# EAGLE schematic Neon_Fader_V2_v376 (EAGLE 9.7.0)
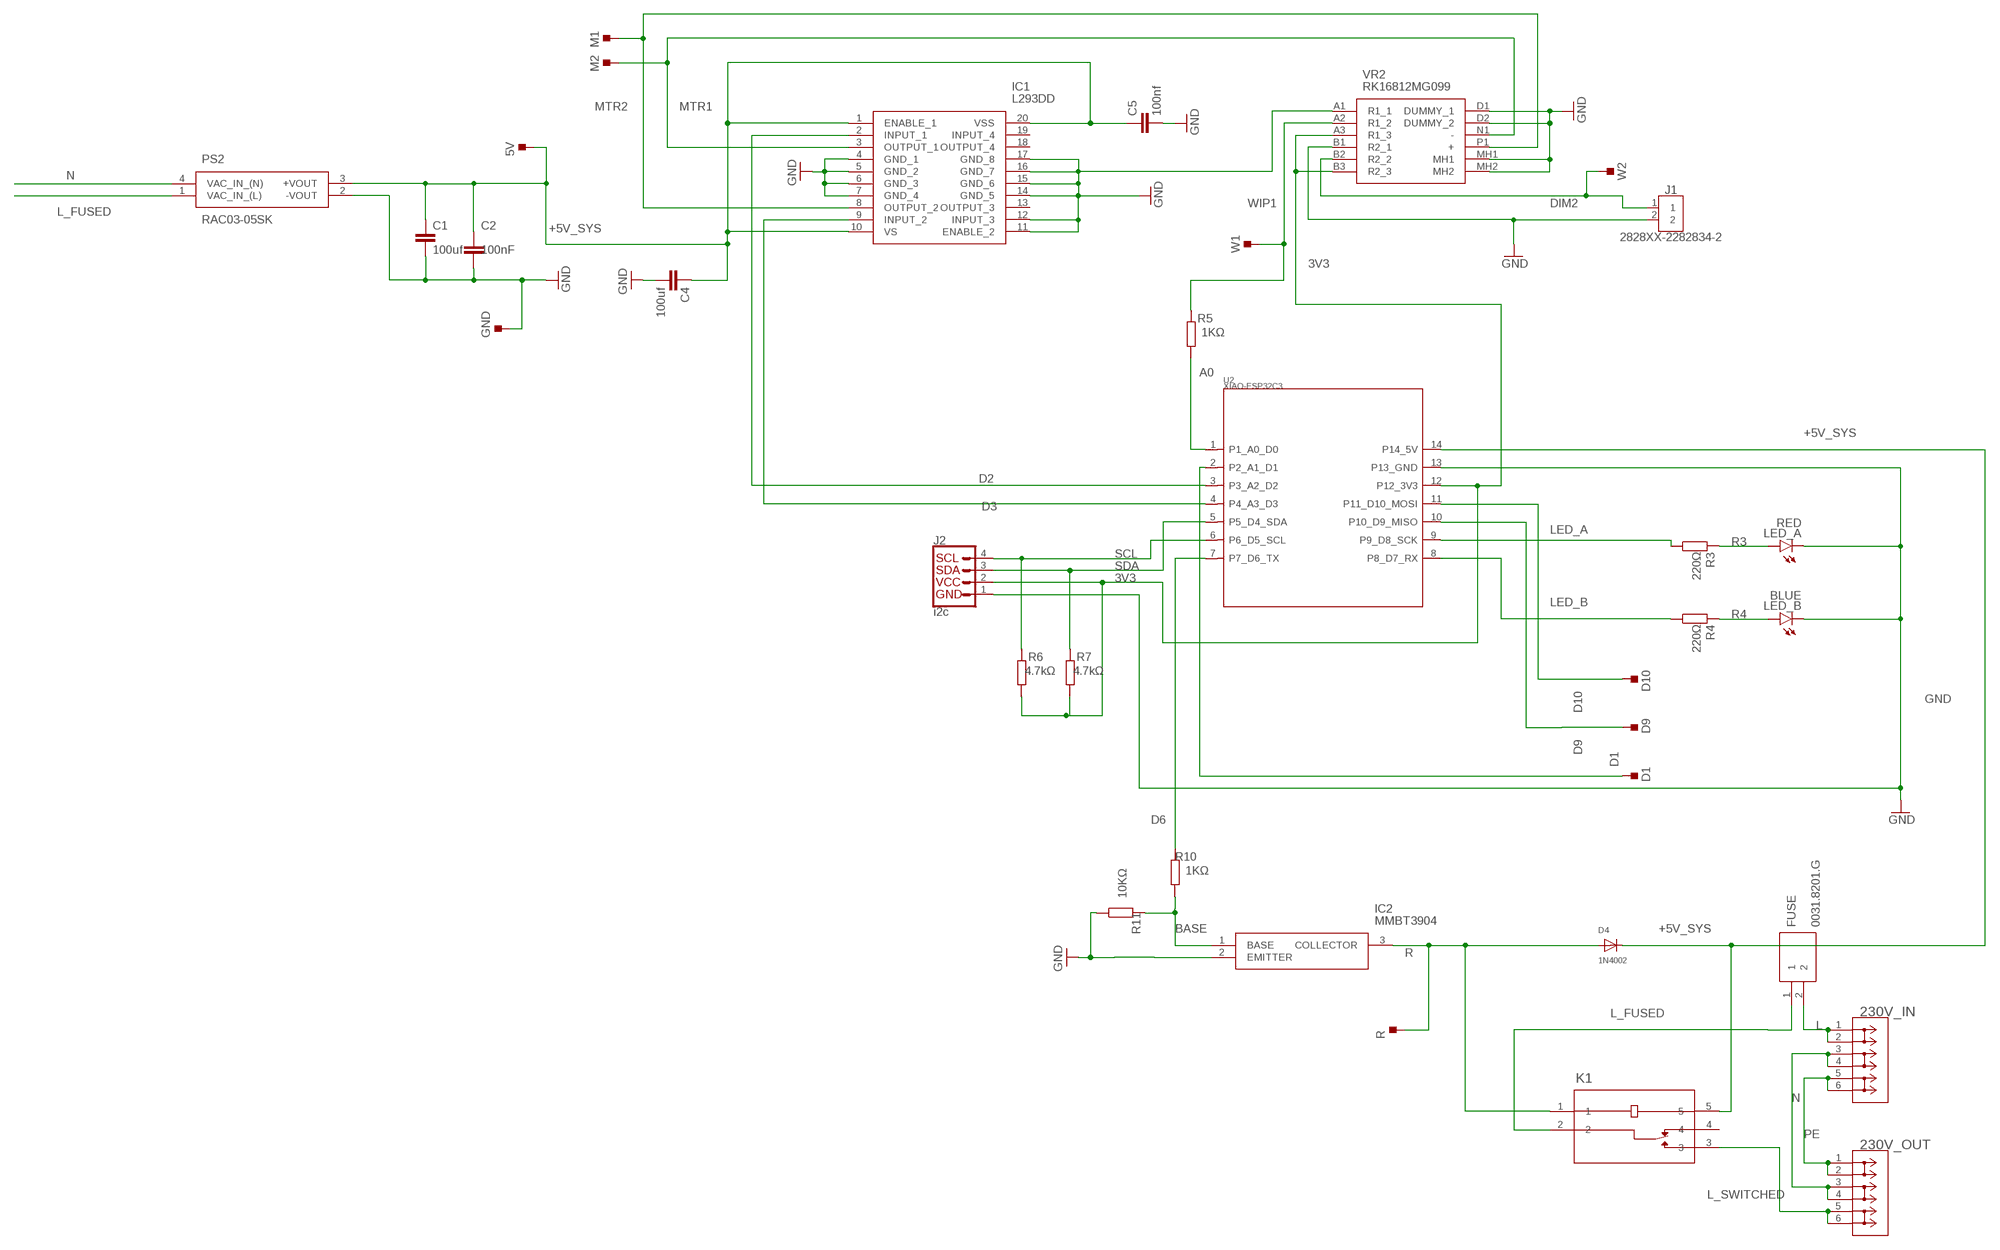
[diagram p0: schematic, sheet 1]

## Parts
5V  TESTPOINT_TPS-PAD-036  [TESTPOINT_PAD-036]
230V_IN  2604-1103CONN3_2604-1103_WAG  [CONN3_2604-1103_WAG]
230V_OUT  2604-1103CONN3_2604-1103_WAG  [CONN3_2604-1103_WAG]
C1  100uf  C-EUC1210  [C1210]
C2  100nF  C-EUC0402  [C0402]
C4  100uf  C-EUC1210  [C1210]
C5  100nf  C-EUC0402  [C0402]
D1  TESTPOINT_TPS-PAD-036  [TESTPOINT_PAD-036]
D4  1N4002  DIODESOD-123  [SOD-123]
D9  TESTPOINT_TPS-PAD-036  [TESTPOINT_PAD-036]
D10  TESTPOINT_TPS-PAD-036  [TESTPOINT_PAD-036]
FUSE  0031.8201.G  [00318201G]
GND  TESTPOINT_TPS-PAD-036  [TESTPOINT_PAD-036]
IC1  L293DD  [SOIC127P1032X265-20N]
IC2  MMBT3904  [SOT95P240X110-3N]
J1  2828XX-2282834-2  [TERMBLK_254-2N]
J2  i2c  QWIIC_CONNECTORJS-1MM  [1X04_1MM_RA]
K1  G6RN-1_DC5RELAY_G6RN-1_OMR  [RELAY_G6RN-1_OMR]
LED_A  RED  LEDCHIPLED_1206  [CHIPLED_1206]
LED_B  BLUE  LEDCHIPLED_1206  [CHIPLED_1206]
M1  TESTPOINT_TPS-PAD-036  [TESTPOINT_PAD-036]
M2  TESTPOINT_TPS-PAD-036  [TESTPOINT_PAD-036]
PS2  RAC03-05SK  [RAC0305SK]
R  TESTPOINT_TPS-PAD-036  [TESTPOINT_PAD-036]
R3  220Ω  R-EU_R0402  [R0402]
R4  220Ω  R-EU_R0402  [R0402]
R5  1KΩ  R-EU_R0402  [R0402]
R6  4.7kΩ  R-EU_R0402  [R0402]
R7  4.7kΩ  R-EU_R0402  [R0402]
R10  1KΩ  R-EU_R0402  [R0402]
R11  10KΩ  R-EU_R0402  [R0402]
U2  XIAO-ESP32C3  XIAO-THRUHOLEHYBRID-SMT-THT  [XIAO-GENERIC-HYBRID-MODULE14P-2.54-21X17.8MM]
VR2  RK16812MG099  [RK16812MG099]
W1  TESTPOINT_TPS-PAD-036  [TESTPOINT_PAD-036]
W2  TESTPOINT_TPS-PAD-036  [TESTPOINT_PAD-036]

## Nets
3V3 [DC]: J2.2(VCC) R6.1 R7.1 U2.12(P12_3V3) VR2.A3(R1_3) VR2.B3(R2_3)
+5V_SYS [DC]: 5V.1(TP) C1.1 C2.1 C4.1 C5.1 D4.C IC1.1(ENABLE_1) IC1.10(VS) IC1.20(VSS) K1.5 PS2.3(+VOUT) U2.14(P14_5V)
A0 [DATA]: R5.1 U2.1(P1_A0_D0)
BASE [DATA]: IC2.1(BASE) R10.1 R11.2
D1 [DATA]: D1.1(TP) U2.2(P2_A1_D1)
D2 [DATA]: IC1.2(INPUT_1) U2.3(P3_A2_D2)
D3 [DATA]: IC1.9(INPUT_2) U2.4(P4_A3_D3)
D6 [DATA]: R10.2 U2.7(P7_D6_TX)
D9 [DATA]: D9.1(TP) U2.10(P10_D9_MISO)
D10 [DATA]: D10.1(TP) U2.11(P11_D10_MOSI)
DIM2 [DATA]: J1.1 VR2.B2(R2_2) W2.1(TP)
GND [DC]: C1.2 C2.2 C4.2 C5.2 GND.1(TP) IC1.4(GND_1) IC1.5(GND_2) IC1.6(GND_3) IC1.7(GND_4) IC1.11(ENABLE_2) IC1.12(INPUT_3) IC1.14(GND_5) IC1.15(GND_6) IC1.16(GND_7) IC1.17(GND_8) IC2.2(EMITTER) J1.2 J2.1(GND) LED_A.C LED_B.C PS2.2(-VOUT) R11.1 U2.13(P13_GND) VR2.A1(R1_1) VR2.B1(R2_1) VR2.D1(DUMMY_1) VR2.D2(DUMMY_2) VR2.MH1 VR2.MH2
L [AC]: 230V_IN.1(1_1) 230V_IN.2(1_2) FUSE.2
L_FUSED [AC]: FUSE.1 K1.2 PS2.1(VAC_IN_(L))
L_SWITCHED [AC]: 230V_OUT.5(3_1) 230V_OUT.6(3_2) K1.3
LED_A [DATA]: R3.1 U2.9(P9_D8_SCK)
LED_B [DATA]: R4.1 U2.8(P8_D7_RX)
MTR1 [DC]: IC1.3(OUTPUT_1) M2.1(TP) VR2.N1(-)
MTR2 [DC]: IC1.8(OUTPUT_2) M1.1(TP) VR2.P1(+)
N [AC]: 230V_IN.3(2_1) 230V_IN.4(2_2) 230V_OUT.3(2_1) 230V_OUT.4(2_2) PS2.4(VAC_IN_(N))
PE [AC]: 230V_IN.5(3_1) 230V_IN.6(3_2) 230V_OUT.1(1_1) 230V_OUT.2(1_2)
R [DATA]: D4.A IC2.3(COLLECTOR) K1.1 R.1(TP)
R3 [DATA]: LED_A.A R3.2
R4 [DATA]: LED_B.A R4.2
SCL [DATA]: J2.4(SCL) R6.2 U2.6(P6_D5_SCL)
SDA [DATA]: J2.3(SDA) R7.2 U2.5(P5_D4_SDA)
WIP1 [DATA]: R5.2 VR2.A2(R1_2) W1.1(TP)
Unconnected: IC1.13(OUTPUT_3) IC1.18(OUTPUT_4) IC1.19(INPUT_4) K1.4

## Library data of the parts
5V D1 D9 D10 GND M1 M2 R W1 W2 = 52101-101-REV-A_v16:TESTPOINT_TPS: TEST POINT PAD; BOM: EXCLUDE
230V_IN 230V_OUT = Wago 2604-1103 Lib:2604-1103; COPYRIGHT: Copyright (C) 2026 Ultra Librarian. All rights reserved.; MANUFACTURER_NAME: Wago; MANUFACTURER_PART_NUMBER: 2604-1103
C1 C2 C4 C5 = rcl:C-EU: CAPACITOR, European symbol; SPICEPREFIX: C
D4 = adafruit:DIODE: Diode SMADIODE - SMA Surface Mount Package 20V 1A Schottky Diode Digikey: 641-1014-6-ND DO-1N4148 - Through Hole Small Current Diode SOD-123 20V 1 A (.5mV Vf) Schottky Diode - Digikey: MBRX120TPMSCT-ND SOD-323 10V 570mA (.38mV Vf, 3ns) Schottky Diode - Digikey: ZLLS410CT-ND SOD-523 30V 30mA Schottky Diode (RB751S-40TE61) - Digikey: RB751S-40TE61CT-ND SOT23-R/W - SOT23 Package (R = Solder Paste/Reflow Ovens, W = Hand-Soldering) BAT54Film 40V 300mA - Digikey: 497-7162-1-ND
FUSE = 0031.8201:0031.8201.G: OGN for THT 22.5mm Source: Datasheet <https://www.schurter.com/en/datasheet/ogn>; ARROW_PART_NUMBER: 0031.8201.G; ARROW_PRICE-STOCK: https://www.arrow.com/en/products/0031.8201.g/schurter?region=europe; DESCRIPTION: OGN for THT 22.5mm; HEIGHT: 12.7mm; MANUFACTURER_NAME: SCHURTER; MANUFACTURER_PART_NUMBER: 0031.8201.G; MOUSER_PART_NUMBER: 693-0031.8201.G; MOUSER_PRICE-STOCK: https://www.mouser.co.uk/ProductDetail/Schurter/0031.8201.G?qs=53fxdJjyGHQ26HnfkWkpvg%3D%3D
IC1 = L293DD:L293DD: L293DD, Motor Driver, 4.5 36 V, 20-Pin SOIC Source: Datasheet <https://www.st.com/resource/en/datasheet/l293d.pdf>; ARROW_PART_NUMBER: L293DD; ARROW_PRICE-STOCK: https://www.arrow.com/en/products/l293dd/stmicroelectronics.html?utm_currency=USD&region=europe; DESCRIPTION: L293DD, Motor Driver, 4.5 36 V, 20-Pin SOIC; HEIGHT: 2.65mm; MANUFACTURER_NAME: STMicroelectronics; MANUFACTURER_PART_NUMBER: L293DD; MOUSER_PART_NUMBER: 511-L293DD; MOUSER_PRICE-STOCK: https://www.mouser.co.uk/ProductDetail/STMicroelectronics/L293DD?qs=m4gxtLzGBzoksItTiSkcgg%3D%3D
IC2 = MMBT3904:MMBT3904: Bipolar Transistors - BJT SOT23 NPN 0.2A 40V G enPur Source: Datasheet <https://www.arrow.com/en/products/mmbt3904/rectron>; ARROW_PART_NUMBER: MMBT3904; ARROW_PRICE-STOCK: https://www.arrow.com/en/products/mmbt3904/rectron?utm_currency=USD&region=nac; DESCRIPTION: Bipolar Transistors - BJT SOT23 NPN 0.2A 40V G enPur; HEIGHT: 1.1mm; MANUFACTURER_NAME: Rectron; MANUFACTURER_PART_NUMBER: MMBT3904; MOUSER_PART_NUMBER: 583-MMBT3904; MOUSER_PRICE-STOCK: https://www.mouser.co.uk/ProductDetail/Rectron/MMBT3904?qs=w%2Fv1CP2dgqqR04yFya3A3w%3D%3D
J1 = Connector:2828XX-2: 2 Position Wire to Board Terminal Block Horizontal with Board Datasheet <https://www.te.com.cn/commerce/DocumentDelivery/DDEController?Action=showdoc&DocId=Catalog+Section%7F1308389_EUROSTYLE_TERMINAL_BLOCKS%7F0607%7Fpdf%7FEnglish%7FENG_CS_1308389_EUROSTYLE_TERMINAL_BLOCKS_0607.pdf%7F2-282837-5>; CATEGORY: Fixed Terminal Blocks; DESCRIPTION: Fixed Terminal Blocks 2P SIDE ENTRY 2.54mm; MANUFACTURER: TE Connectivity AMP Connectors; MPN: 282834-2; OPERATING_TEMPERATURE: -40°C ~ 105°C; PART_STATUS: Active; PITCH: 0.100" (2.54mm); ROHS_COMPLIANCE: RoHS Compliant; SERIES: Buchanan; SUBCATEGORY: Terminal Blocks; TYPE: Through Hole; Screw - Rising Cage Clamp; Side wire entry, Horizontal with Board
J2 = SparkFun-Connectors:QWIIC_CONNECTOR: SparkFun I2C Standard Qwiic Connector An SMD 1mm pitch JST connector makes it easy and quick (get it? Qwiic?) to connect I2C devices to each other. The Qwiic system <http://www.sparkfun.com/qwiic> enables fast and solderless connection between popular platforms and various sensors and actuators. We carry 200mm <https://www.sparkfun.com/products/14204>, 100mm <https://www.sparkfun.com/products/14205>, 50mm <https://www.sparkfun.com/products/14206>, and breadboard friendly <https://www.sparkfun.com/products/14207> Qwiic cables. We also offer 10 pcs strips <https://www.sparkfun.com/products/14323> the SMD connectors.
K1 = G6RN-1 DC5 lib:G6RN-1_DC5; COPYRIGHT: Copyright (C) 2026 Ultra Librarian. All rights reserved.; MANUFACTURER_NAME: Omron; MANUFACTURER_PART_NUMBER: G6RN-1 DC5
LED_A LED_B = led:LED: LED OSRAM: - CHIPLED LG R971, LG N971, LY N971, LG Q971, LY Q971, LO R971, LY R971 LH N974, LH R974 LS Q976, LO Q976, LY Q976 LO Q996 - Hyper CHIPLED LW Q18S LB Q993, LB Q99A, LB R99A - SideLED LS A670, LO A670, LY A670, LG A670, LP A670 LB A673, LV A673, LT A673, LW A673 LH A674 LY A675 LS A676, LA A676, LO A676, LY A676, LW A676 LS A679, LY A679, LG A679 - Hyper Micro SIDELED® LS Y876, LA Y876, LO Y876, LY Y876 LT Y87S - SmartLED LW L88C, LW L88S LB L89C, LB L89S, LG L890 LS L89K, LO L89K, LY L89K LS L896, LA L896, LO L896, LY L896 - TOPLED LS T670, LO T670, LY T670, LG T670, LP T670 LSG T670, LSP T670, LSY T670, LOP T670, LYG T670 LG T671, LOG T671, LSG T671 LB T673, LV T673, LT T673, LW T673 LH T674 LS T676, LA T676, LO T676, LY T676, LB T676, LH T676, LSB T676, LW T676 LB T67C, LV T67C, LT T67C, LS T67K, LO T67K, LY T67K, LW E67C LS E67B, LA E67B, LO E67B, LY E67B, LB E67C, LV E67C, LT E67C LW T67C LS T679, LY T679, LG T679 LS T770, LO T770, LY T770, LG T770, LP T770 LB T773, LV T773, LT T773, LW T773 LH T774 LS E675, LA E675, LY E675, LS T675 LS T776, LA T776, LO T776, LY T776, LB T776 LHGB T686 LT T68C, LB T68C - Hyper Mini TOPLED® LB M676 - Mini TOPLED Santana® LG M470 LS M47K, LO M47K, LY M47K Source: http://www.osram.convergy.de LUXEON: - LUMILED® LXK2-PW12-R00, LXK2-PW12-S00, LXK2-PW14-U00, LXK2-PW14-V00 LXK2-PM12-R00, LXK2-PM12-S00, LXK2-PM14-U00 LXK2-PE12-Q00, LXK2-PE12-R00, LXK2-PE12-S00, LXK2-PE14-T00, LXK2-PE14-U00 LXK2-PB12-K00, LXK2-PB12-L00, LXK2-PB12-M00, LXK2-PB14-N00, LXK2-PB14-P00, LXK2-PB14-Q00 LXK2-PR12-L00, LXK2-PR12-M00, LXK2-PR14-Q00, LXK2-PR14-R00 LXK2-PD12-Q00, LXK2-PD12-R00, LXK2-PD12-S00 LXK2-PH12-R00, LXK2-PH12-S00 LXK2-PL12-P00, LXK2-PL12-Q00, LXK2-PL12-R00 Source: www.luxeon.com KINGBRIGHT: KA-3528ASYC Source: www.kingbright.com
PS2 = RAC03-05SK:RAC03-05SK: AC/DC Power Modules 3W 85-264Vin 05Vout 600mA Source: Datasheet <https://www.mouser.com/datasheet/2/468/RAC03-K-1591915.pdf>; ARROW_PART_NUMBER: RAC03-05SK; ARROW_PRICE-STOCK: https://www.arrow.com/en/products/rac03-05sk/recom-power?utm_currency=USD&region=nac; DESCRIPTION: AC/DC Power Modules 3W 85-264Vin 05Vout 600mA; HEIGHT: 18.4mm; MANUFACTURER_NAME: RECOM Power; MANUFACTURER_PART_NUMBER: RAC03-05SK; MOUSER_PART_NUMBER: 919-RAC03-05SK; MOUSER_PRICE-STOCK: https://www.mouser.co.uk/ProductDetail/RECOM-Power/RAC03-05SK?qs=EBDBlbfErPx1LEo43%2FfYSw%3D%3D
R3-R7 R10 R11 = rcl:R-EU_: RESISTOR, European symbol; SPICEPREFIX: R
U2 = Seeed Studio XIAO Series:XIAO-THRUHOLE: Seeed Studio XIAO Series Through-hole Footprint and Symbol Basic through-hole footprint for Seeed XIAO series of boards. The underside surface mount pads are disabled. For through-hole mounting, a pair of 7-pin, 2.54mm pitch headers with 0.64x0.64mm square leads are recommended. The hybrid variant allows the assembler to choose between surface mount and through-hole mounting methods. However, there is a risk of solder leakage and therefore insufficient solder at the joints if soldering using solder paste and stencils, so we advise using this footprint only when the module is intended to be hand soldered. The symbol pin labels are generic. Please refer to the specific board for more information. Seeed Studio XIAO SAMD21 (Seeeduino XIAO) is also available pre-soldered: Seeed Studio XIAO SAMD21 Pre-soldered - Microchip ATSAMD21G18 Arduino Microcontroller with headers Seeed SKU: 102010388 Buy now <https://www.seeedstudio.com/Seeeduino-XIAO-Pre-Soldered-p-4747.html>
VR2 = RK16812MG099:RK16812MG099: Alps Electric 2 Gang Rotary Potentiometer with a 6 mm Dia. Shaft, +/-20%, 0.05W, Linear RK16812MG099 Source: Datasheet <https://eu.mouser.com/datasheet/2/15/RMP_RK16-1370992.pdf>; DESCRIPTION: Alps Electric 2 Gang Rotary Potentiometer with a 6 mm Dia. Shaft, +/-20%, 0.05W, Linear RK16812MG099; HEIGHT: 25.7mm; MANUFACTURER_NAME: ALPS Electric; MANUFACTURER_PART_NUMBER: RK16812MG099; MOUSER_PART_NUMBER: 688-RK16812MG099; MOUSER_PRICE-STOCK: https://www.mouser.co.uk/ProductDetail/Alps-Alpine/RK16812MG099?qs=uOLQ569YubvkId4TDNOKXQ%3D%3D

## Net classes
1 DATA: width 0.305 mm
2 AC: width 0.762 mm
4 DC: width 0.406 mm